# EAGLE design feather.v4 (EAGLE 9.6.2)
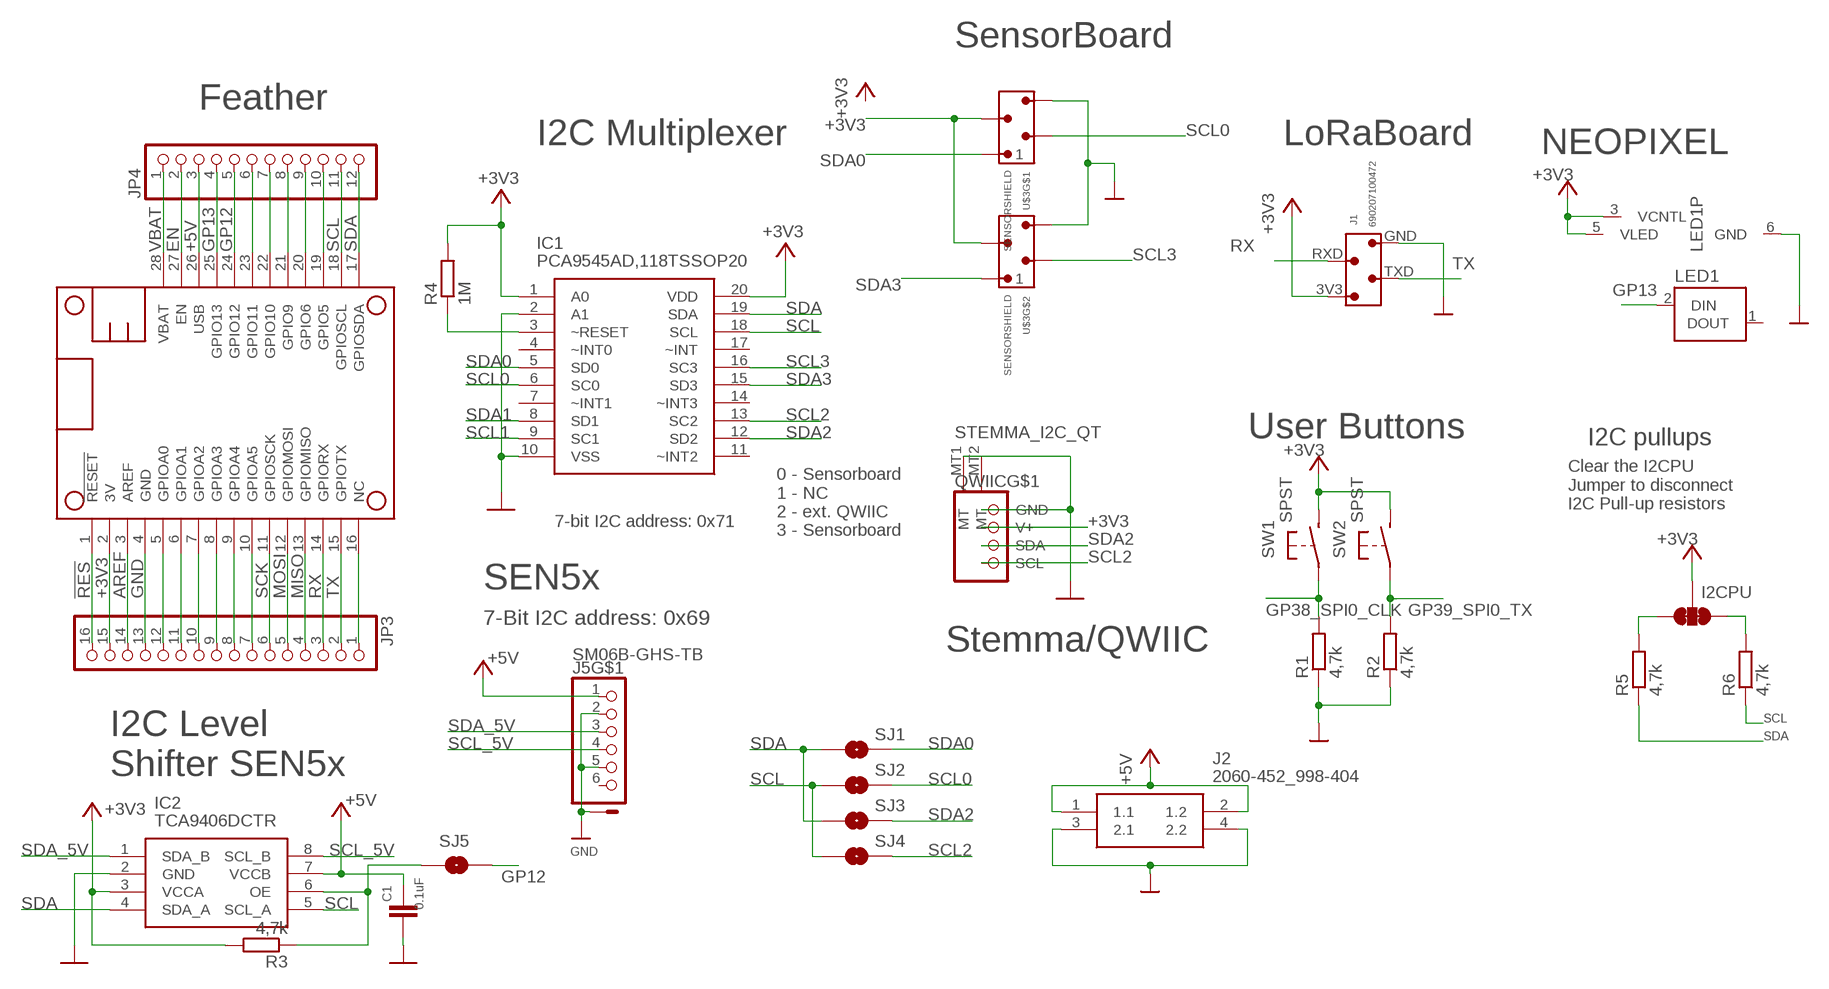
[diagram p0: schematic, sheet 1]

## Parts
C1  0.1uF  C-EUC0603  [C0603]
I2CPU  I2C PU  JUMPER-SMT_3_2-NC_TRACE_SILK  [SMT-JUMPER_3_2-NC_TRACE_SILK]
IC1  PCA9545AD,118TSSOP20  [TSSOP20]
IC2  TCA9406DCTR  [SOP65P400X130-8N]
J1  690207100472  LORASHIELD  [LORASHIELD]
J2  2060-452_998-404  [2060452998404]
J5  SM06B-GHS-TB  JST-PH-06-SMDSMD  [JST-PH-06-SMD]
JP3  HEADER-1X16_76MIL  [1X16_ROUND_76MIL]
JP4  HEADER-1X1276MIL  [1X12_ROUND_76MIL]
LED1  WS2812WS2812  [WS2812]
MS1  FEATHERWING_NODIM  [FEATHERWING_DIM]
QWIIC  STEMMA_I2C_QT  [JST_SH4]
R1  4,7k  R-EU_R0603  [R0603]
R2  4,7k  R-EU_R0603  [R0603]
R3  4,7k  R-EU_R0603  [R0603]
R4  1M  R-EU_R0603  [R0603]
R5  4,7k  R-EU_R0603  [R0603]
R6  4,7k  R-EU_R0603  [R0603]
SJ1  SOLDERJUMPERNO  [SJ_2S-NO]
SJ2  SOLDERJUMPERNO  [SJ_2S-NO]
SJ3  SOLDERJUMPERNO  [SJ_2S-NO]
SJ4  SOLDERJUMPERNO  [SJ_2S-NO]
SJ5  SOLDERJUMPERNO  [SJ_2S-NO]
SW1  SPST  [DTSM-32S-B]
SW2  SPST  [DTSM-32S-B]
U$3  SENSORSHIELD  [SENSORSHIELD]

## Nets
!RES: JP3.16 MS1.1(!RESET)
+3V3: I2CPU.2 IC1.1(A0) IC1.20(VDD) IC2.3(VCCA) J1.3V3 JP3.15 LED1.3(P:VCNTL) LED1.5(P:VLED) MS1.2(3V) QWIIC.2(V+) R3.2 R4.2 SW1.P$2(S) SW2.P$2(S) U$3.3V3_1 U$3.3V3_2
+5V: C1.1 IC2.7(VCCB) J2.1(1.1) J2.2(1.2) J5.1 JP4.3 MS1.26(USB)
AREF: JP3.14 MS1.3(AREF)
EN: JP4.2 MS1.27(EN)
GND: C1.2 IC1.2(A1) IC1.10(VSS) IC2.2(GND) J1.GND J2.3(2.1) J2.4(2.2) J5.2 J5.5 J5.7(SHIELD1:S) J5.8(SHIELD1:S) JP3.12 JP3.13 LED1.6(P:GND) MS1.4(GND) MS1.5(GPIOA0) QWIIC.1(GND) QWIIC.MT1(MT) QWIIC.MT2(MT) R1.1 R2.1 U$3.GND_1 U$3.GND_2
GP12: JP4.5 MS1.24(GPIO12) SJ5.2
GP13: JP4.4 LED1.2( :DIN) MS1.25(GPIO13)
GP38_SPI0_CLK: R1.2 SW1.P$1(P)
GP39_SPI0_TX: R2.2 SW2.P$1(P)
MISO: JP3.4 MS1.13(GPIOMISO)
MOSI: JP3.5 MS1.12(GPIOMOSI)
N$1: IC2.6(OE) R3.1 SJ5.1
N$2: JP3.1 MS1.16(NC)
N$8: IC1.3(~RESET) R4.1
N$9: I2CPU.3 R5.2
N$10: I2CPU.1 R6.2
N$13: JP3.7 MS1.10(GPIOA5)
N$14: JP3.8 MS1.9(GPIOA4)
N$15: JP3.9 MS1.8(GPIOA3)
N$16: JP3.10 MS1.7(GPIOA2)
N$17: JP3.11 MS1.6(GPIOA1)
N$23: JP4.6 MS1.23(GPIO11)
N$24: JP4.7 MS1.22(GPIO10)
N$25: JP4.8 MS1.21(GPIO9)
N$26: JP4.9 MS1.20(GPIO6)
N$27: JP4.10 MS1.19(GPIO5)
RX: J1.RXD JP3.3 MS1.14(GPIORX)
SCK: JP3.6 MS1.11(GPIOSCK)
SCL: IC1.18(SCL) IC2.5(SCL_A) JP4.11 MS1.18(GPIOSCL) R6.1 SJ2.1 SJ4.1
SCL0: IC1.6(SC0) SJ2.2 U$3.SCL0
SCL1: IC1.9(SC1)
SCL2: IC1.13(SC2) QWIIC.4(SCL) SJ4.2
SCL3: IC1.16(SC3) U$3.SCL1
SCL_5V: IC2.8(SCL_B) J5.4
SDA: IC1.19(SDA) IC2.4(SDA_A) JP4.12 MS1.17(GPIOSDA) R5.1 SJ1.1 SJ3.1
SDA0: IC1.5(SD0) SJ1.2 U$3.SDA0
SDA1: IC1.8(SD1)
SDA2: IC1.12(SD2) QWIIC.3(SDA) SJ3.2
SDA3: IC1.15(SD3) U$3.SDA1
SDA_5V: IC2.1(SDA_B) J5.3
TX: J1.TXD JP3.2 MS1.15(GPIOTX)
VBAT: JP4.1 MS1.28(VBAT)
Unconnected: IC1.4(~INT0) IC1.7(~INT1) IC1.11(~INT2) IC1.14(~INT3) IC1.17(~INT) J5.6 LED1.1( :DOUT)

## Notes on the sheet
- SensorBoard
- Feather
- I2C Multiplexer | LoRaBoard | NEOPIXEL
- User Buttons
- I2C pullups
- Clear the I2CPU 
  Jumper to disconnect
  I2C Pull-up resistors
- 7-bit I2C address: 0x71
- 0 - Sensorboard
  1 - NC
  2 - ext. QWIIC
  3 - Sensorboard
- SEN5x
- 7-Bit I2C address: 0x69
- Stemma/QWIIC
- I2C Level
  Shifter SEN5x

## Library data of the parts
C1 = rcl:C-EU: CAPACITOR, European symbol; SPICEPREFIX: C
I2CPU = SparkFun-Jumpers:JUMPER-SMT_3_2-NC_TRACE: Normally closed trace jumper (2 of 2 connections) This jumper has a trace between all three pads so they are normally closed (NC). Use a razor knife to open the connection(s). For best results follow the IPC guidelines for cutting traces: Cutout at least 0.063 mm (0.005 in). Remove all loose material to clean up the cut area. Seal the cut with an approved epoxy. Reapply solder to reclose the connection(s).
IC1 = HSW_ATM-IC:PCA9545AD,118: 4-channel I2C-bus switch with interrupt logic and reset Source: Datasheet
IC2 = SamacSys_Parts:TCA9406DCTR: 2-Bit Bidirectional 1-MHz I2C Bus and SMBus Voltage-Level Shifter Source: Datasheet <http://www.ti.com/lit/ds/symlink/tca9406.pdf>; DESCRIPTION: 2-Bit Bidirectional 1-MHz I2C Bus and SMBus Voltage-Level Shifter; HEIGHT: 1.3mm; MANUFACTURER_NAME: Texas Instruments; MANUFACTURER_PART_NUMBER: TCA9406DCTR; MOUSER_PART_NUMBER: 595-TCA9406DCTR; MOUSER_PRICE-STOCK: https://www.mouser.co.uk/ProductDetail/Texas-Instruments/TCA9406DCTR?qs=Ze4%2FuFuz19L6Yntu0RTUyw%3D%3D
J1 = LoRaShieldE5:LORASHIELD: WR-MM Transition Connector KIND PROPERTIES: Pitch 2.54 mm Gender:Transition MATERIAL PROPERTIES: Insulator Material:PBT Insulator Flammability Rating UL94 V-0 Insulator Color:Red Contact Material :Phosphor Bronze Contact Plating :Mat Tin over Nickel Contact Type: Stamped GENERAL PROPERTIES: Operating Temperature:-40 °C up to +105 °C Compliance Lead free / RoHS ELECTRICAL PROPERTIES: IR 1:1 A Working Voltage 100 V (AC) Withstanding Voltage:500 V (AC) Contact Resistance: 10 mΩ Insulation Resistance:1000 MΩ PACKAGING PROPERTIES: cULus Approval:E323964 Packaging :Tube <https://katalog.we-online.com/media/images/v2/o33156v209%20Family_WR-MM_69020710xx72.jpg> Details see: https://katalog.we-online.com/en/em/MM_TRANSITION_CONNECTOR_69020710XX72 Updated by Yingchun,Shan 2019-10-28 2019 (C) Würth Elektronik; CONTACT-RESISTANCE: 10mOhm; DATASHEET-URL: https://www.we-online.com/catalog/datasheet/690207100472.pdf; GENDER: Transition; IR: 1A; L: 8.51mm; PACKAGING: Tube; PART-NUMBER: 690207100472; PINS: 4; PITCH: 2.54; TYPE: Straight; WORKING-VOLTAGE: 100V(AC)
J2 = 2060-452_998-404:2060-452_998-404: SMD PCB terminal block; push-button; 0.75 mm; Pin spacing 4 mm; 2-pole; Push-in CAGE CLAMP; in tape-and-reel packaging Source: Datasheet <https://www.wago.com/2060-452/998-404>; ARROW_PART_NUMBER: 2060-452/998-404; ARROW_PRICE-STOCK: https://www.arrow.com/en/products/2060-452998-404/wago-kontakttechnik-gmbh?region=nac; DESCRIPTION: SMD PCB terminal block; push-button; 0.75 mm; Pin spacing 4 mm; 2-pole; Push-in CAGE CLAMP; in tape-and-reel packaging; HEIGHT: 4.5mm; MANUFACTURER_NAME: Wago; MANUFACTURER_PART_NUMBER: 2060-452/998-404
J5 = HSW_ATM-Connector_JST:JST-PH-06-SMD
JP3 = microbuilder:HEADER-1X16: PIN HEADER
JP4 = microbuilder:HEADER-1X12
LED1 = WS2812:WS2812
MS1 = microbuilder:FEATHERWING
QWIIC = microbuilder:STEMMA_I2C
R1-R6 = rcl:R-EU_: RESISTOR, European symbol; SPICEPREFIX: R
SJ1-SJ5 = HSW_ATM-Passives:SOLDERJUMPER: Solder Jumper Standard SMD solder jumper. Used to automate production. Two varients : Normally Open and Normally Closed are the same, but have different paste layers. NC will have a large amount of paste and should jumper during reflow.
SW1 SW2 = HSW_ATM-Passives:SPST
U$3 = sensorshield:SENSORSHIELD

## Net classes
1 highpower: width 0.406 mm, drill 0.483 mm
2 lowpower: width 0.152 mm, drill 0.3 mm

## Board
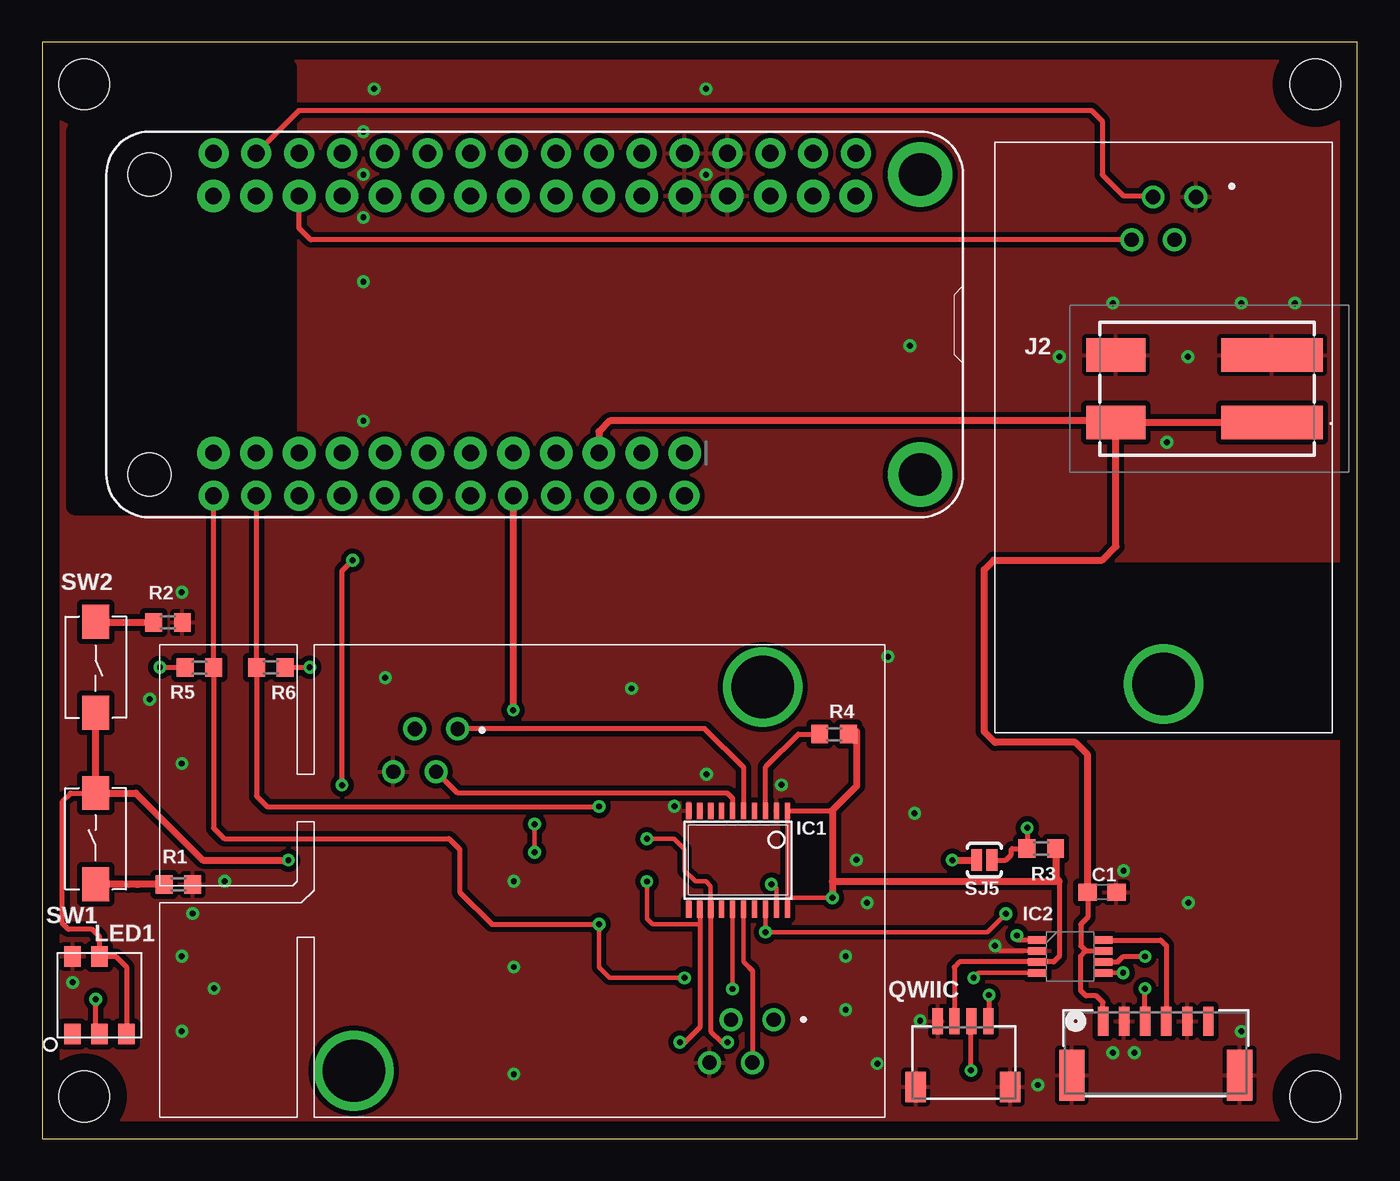
[diagram p1: board, top side]
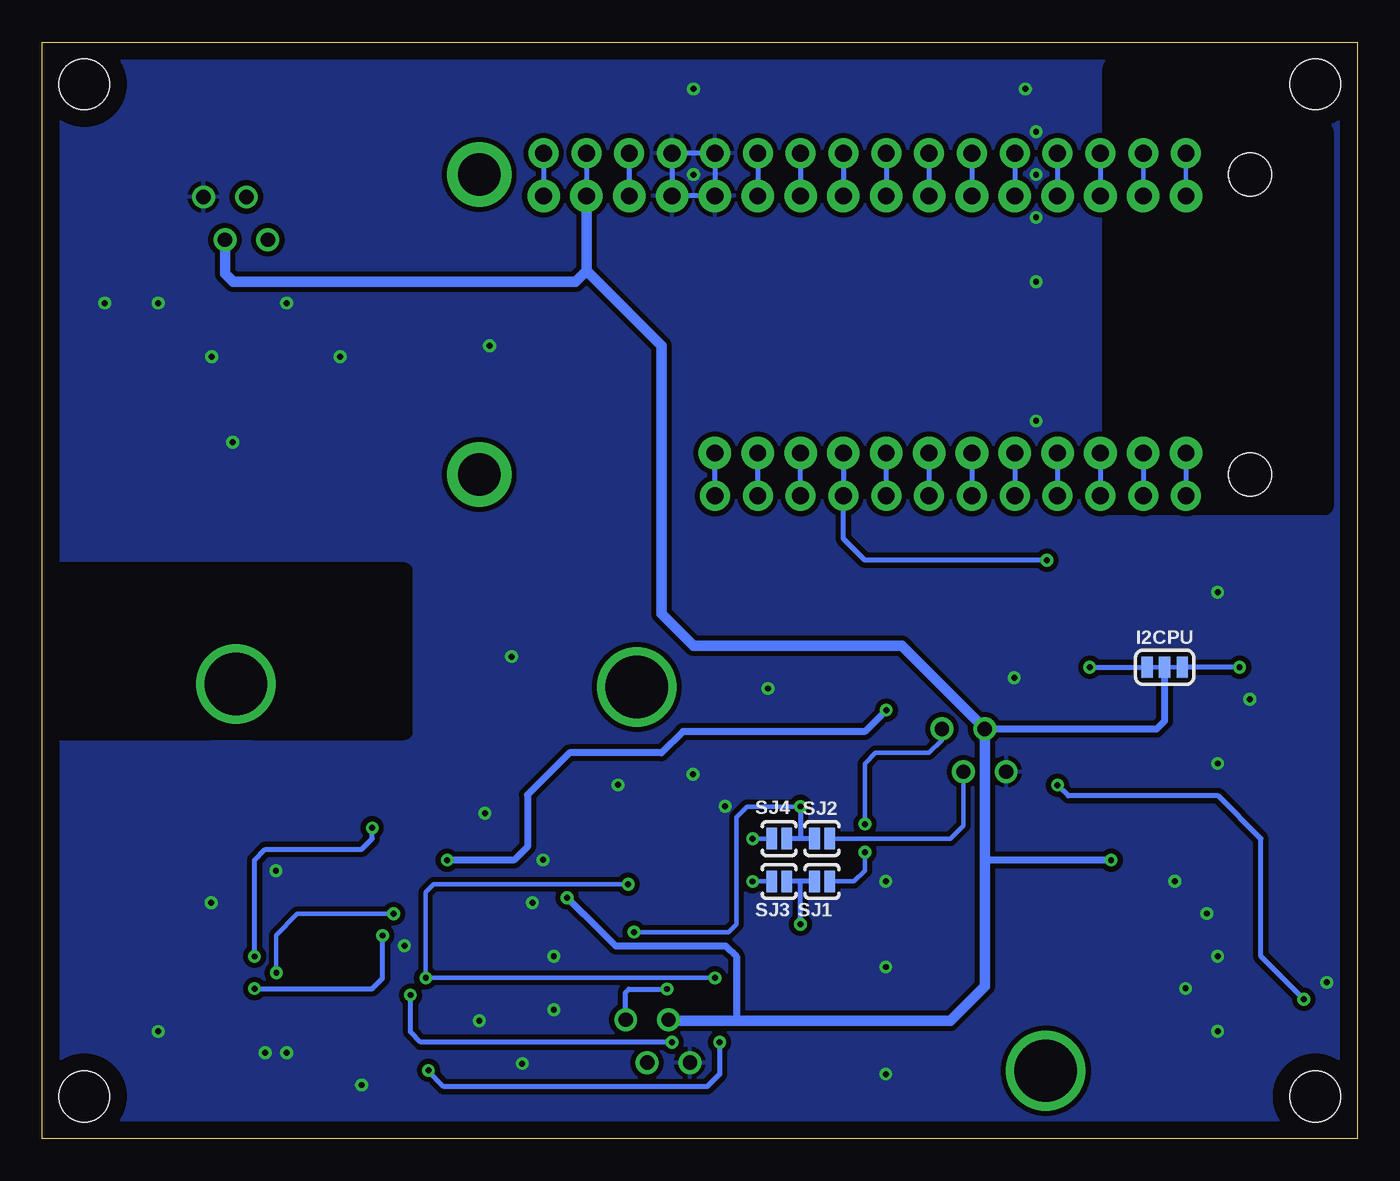
[diagram p2: board, bottom side, seen from below]

Size 78 x 65 mm. Coordinates in mm from the lower left corner, seen from the top.
Outline: 0,0 78,0 78,65 0,65 0,0
Copper layers (1*16): Top 0.035mm / dielectric 1.5mm / Bottom 0.035mm
Design rules "default *": minimum track width 3mil, minimum drill 0.3mm, track to track 6mil, track to pad 6mil, pad to pad 6mil, via to via 6mil, smd to smd 6mil, copper to edge 40mil, drill to drill 6mil, minimum pad ring 10mil, minimum via ring 8mil, stop-mask expansion 4mil, vias tented up to drill 0.3mm, thermal gap 10mil
Holes 3 mm at 2.5,2.5 75.5,2.5 75.5,62.5 2.5,62.5
tRestrict: area 1.9,37.5 to 14.6,63.5; area 56.5,24.1 to 76.8,33.7; area 65.4,24.1 to 67.9,24.3
bRestrict: area 1.9,37.5 to 14.6,63.5; area 56.5,24.1 to 76.8,33.7; area 65.4,24.1 to 67.9,24.4

### Footprints (pad centres in the part's own frame; a part is rotated, then mirrored left to right if it is on the bottom)
C0603 = smd 1.1 x 1: 1 -0.85,0; 2 0.85,0
SMT-JUMPER_3_2-NC_TRACE_SILK = smd 0.66 x 1.27: 1 -1.041,0; 2 0,0; 3 1.041,0
TSSOP20 = smd 0.305 x 0.991: 1 -2.925,-2.918; 2 -2.275,-2.918; 3 -1.625,-2.918; 4 -0.975,-2.918; 5 -0.325,-2.918; 6 0.325,-2.918; 7 0.975,-2.918; 8 1.625,-2.918; 9 2.275,-2.918; 10 2.925,-2.918; 11 2.925,2.918; 12 2.275,2.918; 13 1.625,2.918; 14 0.975,2.918; 15 0.325,2.918; 16 -0.325,2.918; 17 -0.975,2.918; 18 -1.625,2.918; 19 -2.275,2.918; 20 -2.925,2.918
SOP65P400X130-8N = smd 1.1 x 0.45: 1 -1.95,0.975; 2 -1.95,0.325; 3 -1.95,-0.325; 4 -1.95,-0.975; 5 1.95,-0.975; 6 1.95,-0.325; 7 1.95,0.325; 8 1.95,0.975
LORASHIELD = drill 0.85: 3V3 5.773,10.642; GND 3.233,11.912; RXD 5.773,8.102; TXD 3.233,9.372 | drill 3.7: P$1 32.111,10
2060452998404 = smd 6 x 2: 1 -3.725,2; 3 -3.725,-2 | smd 3.5 x 2: 2 5.525,2; 4 5.525,-2
JST-PH-06-SMD = smd 0.61 x 1.702: 1 -3.125,1.876; 2 -1.875,1.876; 3 -0.625,1.876; 4 0.625,1.876; 5 1.875,1.876; 6 3.125,1.876 | smd 1.5 x 3: 7 -4.975,-1.324; 8 4.975,-1.324
1X16_ROUND_76MIL = drill 1 pad 1.93: 1 -19.05,0; 2 -16.51,0; 3 -13.97,0; 4 -11.43,0; 5 -8.89,0; 6 -6.35,0; 7 -3.81,0; 8 -1.27,0; 9 1.27,0; 10 3.81,0; 11 6.35,0; 12 8.89,0; 13 11.43,0; 14 13.97,0; 15 16.51,0; 16 19.05,0
1X12_ROUND_76MIL = drill 1 pad 1.93: 1 -13.97,0; 2 -11.43,0; 3 -8.89,0; 4 -6.35,0; 5 -3.81,0; 6 -1.27,0; 7 1.27,0; 8 3.81,0; 9 6.35,0; 10 8.89,0; 11 11.43,0; 12 13.97,0
WS2812 = smd 1.2 x 1: 1 -2.3,1.6; 2 -2.3,0; 3 -2.3,-1.6; 5 2.3,0; 6 2.3,1.6
FEATHERWING_DIM = drill 1 pad 1.778: 1 6.35,1.27; 2 8.89,1.27; 3 11.43,1.27; 4 13.97,1.27; 5 16.51,1.27; 6 19.05,1.27; 7 21.59,1.27; 8 24.13,1.27; 9 26.67,1.27; 10 29.21,1.27; 11 31.75,1.27; 12 34.29,1.27; 13 36.83,1.27; 14 39.37,1.27; 15 41.91,1.27; 16 44.45,1.27; 17 44.45,21.59; 18 41.91,21.59; 19 39.37,21.59; 20 36.83,21.59; 21 34.29,21.59; 22 31.75,21.59; 23 29.21,21.59; 24 26.67,21.59; 25 24.13,21.59; 26 21.59,21.59; 27 19.05,21.59; 28 16.51,21.59 | drill 2.5 pad 3.81: P$1 2.54,20.32; P$2 2.54,2.54 | hole 2.54: 48.26,20.32; 48.26,2.54
JST_SH4 = smd 0.6 x 1.55: 1 -1.5,2.514; 2 -0.5,2.514; 3 0.5,2.514; 4 1.5,2.514 | smd 1.2 x 1.8: MT1 -2.8,-1.386; MT2 2.8,-1.386
R0603 = smd 1 x 1.1: 1 -0.85,0; 2 0.85,0
SJ_2S-NO = smd 0.635 x 1.27: 1 -0.45,0; 2 0.45,0
DTSM-32S-B = smd 2 x 1.6: P$1 -2.7,0; P$2 2.7,0
SENSORSHIELD = drill 0.85: 3V3_1 15.113,23.019; 3V3_2 33.864,5.77; GND_1 13.843,20.479; GND_2 32.594,3.23; SCL0 16.383,20.479; SCL1 35.134,3.23; SDA0 17.653,23.019; SDA1 36.404,5.77 | drill 3.7: P$1 11.496,2.75; P$2 35.746,25.5

### Placement (x,y rotation side)
C1  62.87,14.61 0 top
I2CPU  11.43,27.94 0 bottom
IC1  41.27,16.51 180 top
IC2  60.96,10.79 0 top
J1  56.52,59.05 270 top
J2  69.22,44.45 180 top
J5  66.04,5.08 0 top
JP3  29.21,55.88 0 top
JP4  24.13,40.64 180 top
LED1  3.4,8.5 90 top
MS1  54.61,59.69 180 top
QWIIC  54.61,4.45 0 top
R1  8.08,15.06 180 top
R2  7.47,30.61 180 top
R3  59.26,17.2 0 top
R4  46.96,23.98 0 top
R5  9.32,27.91 180 top
R6  13.56,27.94 0 top
SJ1  31.75,15.24 0 bottom
SJ2  31.75,17.78 0 bottom
SJ3  34.29,15.24 180 bottom
SJ4  34.29,17.78 180 bottom
SJ5  55.88,16.51 180 top
SW1  3.17,17.78 90 top
SW2  3.17,27.94 270 top
U$3  6.99,1.27 0 top

### Tracks (layer width: path | path; a pad name or v marks a point on that pad's centre or on a via)
!RES
  Bottom 0.305: MS1.1 JP3.16
+3V3  (via drill 0.35)
  Top 0.254: IC1.1 44.2,14.3 | 44.2,14.3 IC1.20 | v46.86,14.28 44.23,14.28 44.2,14.3
  Top 0.305: 60.33,15.24 60.33,10.79 60,10.47 IC2.3 54.41,10.47 54.1,10.16 QWIIC.2 | R3.2 | IC1.1 46.8,19.43 | R4.2 47.97,24.13 48.31,24.13 | LED1.3 5,10.16 4.36,10.8 LED1.5 3.4,11.97 2.97,12.39 1.55,12.39 1.19,12.75 1.19,19.99 1.68,20.48 SW1.P$2
  Top 0.406: 46.86,19.37 46.86,15.24 | 46.86,15.24 v46.86,14.28 | v14.61,16.51 9.53,16.51 5.55,20.48 SW1.P$2 SW2.P$2 | 48.31,24.13 48.31,20.9 46.83,19.43 46.8,19.43 | R3.2 60.11,15.46 60.33,15.24 46.86,15.24
  Bottom 0.305: MS1.2 JP3.15
  Bottom 0.406: v46.86,14.28 45.9,13.31 45.87,13.31 43.99,11.43 37.47,11.43 36.83,10.79 36.83,6.99 | v14.61,16.51 22.1,16.51 | U$3.3V3_1 11.91,24.29 11.43,24.77 I2CPU.2
  Bottom 0.61: U$3.3V3_2 40.79,6.99 36.83,6.99 24.13,6.99 22.1,9.02 22.1,16.51 U$3.3V3_1 27.02,29.21 39.37,29.21 41.27,31.11 41.27,46.99 45.72,51.44 | 45.72,51.44 JP3.15 | J1.3V3 67.16,51.28 66.67,50.8 46.35,50.8 45.72,51.44
+5V
  Top 0.305: 61.91,11.12 61.59,11.43 61.59,12.7 62.02,13.12 C1.1 | 61.91,11.12 IC2.7 | J5.1 62.91,8.08 62.53,8.46 61.9,8.46 61.59,8.76 61.59,10.81 61.91,11.12
  Top 0.406: JP4.3 33.02,41.91 33.66,42.55 62.02,42.55 62.11,42.45 J2.2 | J2.1 J2.2 | C1.1 62.02,22.75 61.27,23.5 56.52,23.5 55.88,24.13 55.88,33.73 56.44,34.29 62.87,34.29 63.69,35.12 J2.2
  Bottom 0.305: MS1.26 JP4.3
AREF
  Bottom 0.305: MS1.3 JP3.14
EN
  Bottom 0.305: MS1.27 JP4.2
GND  (via drill 0.35)
  Top 0.254: IC2.2 56.83,11.12 v56.52,11.43
  Bottom 0.305: MS1.5 JP3.12 JP3.13 MS1.4 MS1.5
  other vias: 51.74,19.28 50.16,28.57 39.4,21.6 37.49,19.7 43.84,20.96 27.97,10.17 27.97,15.25 47.66,7.63 47.66,10.8 48.92,13.98 39.37,57.15 39.37,62.23 19.68,62.23 19.05,57.15 19.05,54.61 19.05,59.69 19.05,50.8 19.05,42.55 10.19,8.9 8.29,22.23 6.38,26.05 8.29,10.8 8.29,6.36 48.29,16.52 67.97,13.98 66.7,41.28 51.47,47 34.95,26.68 27.97,3.82 20.35,27.32 1.81,9.26 63.5,49.53 74.3,49.53 71.12,49.53 60.33,46.35 67.94,46.35 64.77,5.08 63.5,5.08 59.05,3.17 49.53,4.45 71.12,6.35 64.14,15.88 52.07,6.99 10.82,15.25 8.92,13.35 8.29,32.4
  pour Top (isolate 0.305): -4,-2 81.92,-2 81.92,67.94 -4,67.94
  pour Bottom (isolate 0.305): -2.54,-1 0,-1 80.64,-1 80.64,66.67 -2.54,66.67
GP12  (via drill 0.35)
  Top 0.406: MS1.24 v27.94,25.4 | v53.98,16.51 SJ5.2
  Bottom 0.305: MS1.24 JP4.5
  Bottom 0.406: v27.94,25.4 29.21,24.13 40.01,24.13 41.27,22.86 46.74,22.86 49.23,20.37 49.23,17.3 50.01,16.51 v53.98,16.51
GP13  (via drill 0.35)
  Top 0.305: LED1.2 3.17,6.42 v3.17,8.26 | v17.78,20.95 17.78,33.66 v18.41,34.29
  Bottom 0.305: JP4.4 MS1.25 30.48,35.56 29.21,34.29 v18.41,34.29 | v3.17,8.26 5.71,10.79 5.71,17.78 8.26,20.32 17.14,20.32 v17.78,20.95
GP38_SPI0_CLK
  Top 0.406: SW1.P$1 5.1,15.08 5.12,15.06 5.6,15.06 5.71,15.06 R1.2
GP39_SPI0_TX
  Top 0.305: SW2.P$1 3.18,30.61
  Top 0.406: 3.18,30.61 R2.2
MISO
  Bottom 0.305: MS1.13 JP3.4
MOSI
  Bottom 0.305: MS1.12 JP3.5
N$1  (via drill 0.35)
  Top 0.305: SJ5.1 57.15,16.51 57.48,16.84 57.48,17.14 57.53,17.2 R3.1 v58.42,18.41 | IC2.6 63.81,10.47 64.14,10.79 v65.41,10.79
  Bottom 0.305: v65.41,10.79 65.41,16.51 64.77,17.14 59.05,17.14 58.42,17.78 v58.42,18.41
N$2
  Bottom 0.254: MS1.16 JP3.1
N$8
  Top 0.305: IC1.3 42.9,22.03 44.84,23.98 R4.1
N$9  (via drill 0.35)
  Top 0.305: R5.2 7.01,27.91 v6.99,27.94
  Bottom 0.305: v6.99,27.94 I2CPU.3
N$10  (via drill 0.35)
  Top 0.305: R6.2 v15.88,27.94
  Bottom 0.305: v15.88,27.94 I2CPU.1
N$13
  Bottom 0.305: MS1.10 JP3.7
N$14
  Bottom 0.305: MS1.9 JP3.8
N$15
  Bottom 0.305: MS1.8 JP3.9
N$16
  Bottom 0.305: MS1.7 JP3.10
N$17
  Bottom 0.305: MS1.6 JP3.11
N$23
  Bottom 0.305: JP4.6 MS1.23
N$24
  Bottom 0.305: JP4.7 MS1.22
N$25
  Bottom 0.305: JP4.8 MS1.21
N$26
  Bottom 0.305: JP4.9 MS1.20
N$27
  Bottom 0.305: JP4.10 MS1.19
RX
  Top 0.305: J1.RXD 15.93,53.28 15.24,53.98 JP3.3
  Bottom 0.305: MS1.14 JP3.3
SCK
  Bottom 0.305: MS1.11 JP3.6
SCL  (via drill 0.35)
  Top 0.254: IC1.18 v42.9,12.24 56.06,12.24 v57.15,13.34 | v64.11,9.83 IC2.5
  Top 0.305: MS1.18 12.71,38.09 R6.1 12.71,20.31 13.34,19.68 v33.02,19.68
  Bottom 0.254: v42.9,12.24 37.29,12.24 36.83,12.7 36.83,19.05 36.2,19.68 v33.02,19.68 | v57.15,13.34 62.87,13.34 64.14,12.06 64.14,9.86 v64.11,9.83
  Bottom 0.305: SJ2.1 33.02,17.78 | 33.02,17.78 SJ4.1 | v33.02,19.68 33.02,17.78 | JP4.11 MS1.18
SCL0
  Top 0.305: IC1.6 40.95,20.16 40.64,20.47 24.64,20.47 U$3.SCL0
  Bottom 0.254: SJ2.2 24.13,17.78 23.37,18.54 U$3.SCL0
SCL1
  Top 0.254: 38.99,19.42 IC1.9
SCL2  (via drill 0.35)
  Top 0.254: v35.87,17.78 37.47,17.78 38.1,17.14 38.1,15.88 38.73,15.24 39.37,15.24 39.65,14.96 IC1.13
  Top 0.305: IC1.13 39.65,6.37 40.31,5.71 v40.64,5.71 | v56.16,8.51 56.16,7.01 QWIIC.4
  Bottom 0.254: SJ4.2 v35.87,17.78
  Bottom 0.305: v40.64,5.71 55.55,5.71 56.16,6.33 v56.16,8.51
SCL3
  Top 0.254: IC1.16 41.6,10.47 41.91,10.16
  Top 0.305: 41.91,10.16 42.12,9.95 U$3.SCL1
SCL_5V
  Top 0.305: IC2.8 66.33,11.77 66.67,11.43 J5.4
SDA  (via drill 0.35)
  Top 0.254: IC2.4 55.54,9.82 v55.24,9.53 | v38.1,9.53 33.66,9.53 33.02,10.16 v33.02,12.7 | IC1.19 43.55,14.85 43.28,15.11 v43.24,15.07
  Top 0.305: MS1.17 10.16,27.93 R5.1 10.17,18.4 10.79,17.78 24.13,17.78 24.77,17.14 24.77,14.61 26.67,12.7 v33.02,12.7
  Bottom 0.254: v38.1,9.53 v55.24,9.53 55.24,14.61 54.77,15.07 v43.24,15.07
  Bottom 0.305: SJ1.1 33.02,15.24 | 33.02,15.24 SJ3.1 | v33.02,12.7 33.02,15.24 | JP4.12 MS1.17
SDA0  (via drill 0.35)
  Top 0.254: v29.21,16.97 v29.21,18.64
  Top 0.305: IC1.5 41.6,22 39.29,24.31 24.66,24.31 U$3.SDA0
  Bottom 0.254: SJ1.2 29.84,15.24 29.21,15.88 v29.21,16.97 | v29.21,18.64 29.21,22.23 28.57,22.86 25.4,22.86 24.64,23.62 U$3.SDA0
SDA2  (via drill 0.35)
  Top 0.254: v35.87,15.24 35.87,13.03 36.2,12.7 39,12.7
  Top 0.305: v37.82,5.71 37.82,5.61 38.02,5.61 39,6.59 39,12.7 IC1.12 | v55.09,4.04 55.09,6.94 QWIIC.3
  Bottom 0.254: SJ3.2 v35.87,15.24
  Bottom 0.305: v37.82,5.71 37.82,3.81 38.56,3.07 54.18,3.07 55.12,4.01 v55.09,4.04
SDA3  (via drill 0.35)
  Top 0.254: v40.95,8.87 IC1.15
  Bottom 0.305: U$3.SDA1 43.39,8.68 43.2,8.87 v40.95,8.87
SDA_5V  (via drill 0.35)
  Top 0.305: J5.3 65.41,6.97 v65.41,8.89 | v57.81,12.04 57.81,11.77 IC2.1
  Bottom 0.305: v65.41,8.89 58.42,8.89 57.81,9.5 v57.81,12.04
TX
  Top 0.305: J1.TXD 65.83,55.88 64.14,55.88 62.87,57.15 62.87,60.33 62.23,60.96 15.24,60.96 MS1.15
  Bottom 0.254: MS1.15 JP3.2
VBAT
  Bottom 0.305: MS1.28 JP4.1

### Text on the board
tDocu: Featherboard | - | + | LoRa E5 | SEN5x | Sensorboard
bDocu: Basisboard Feather / 241229